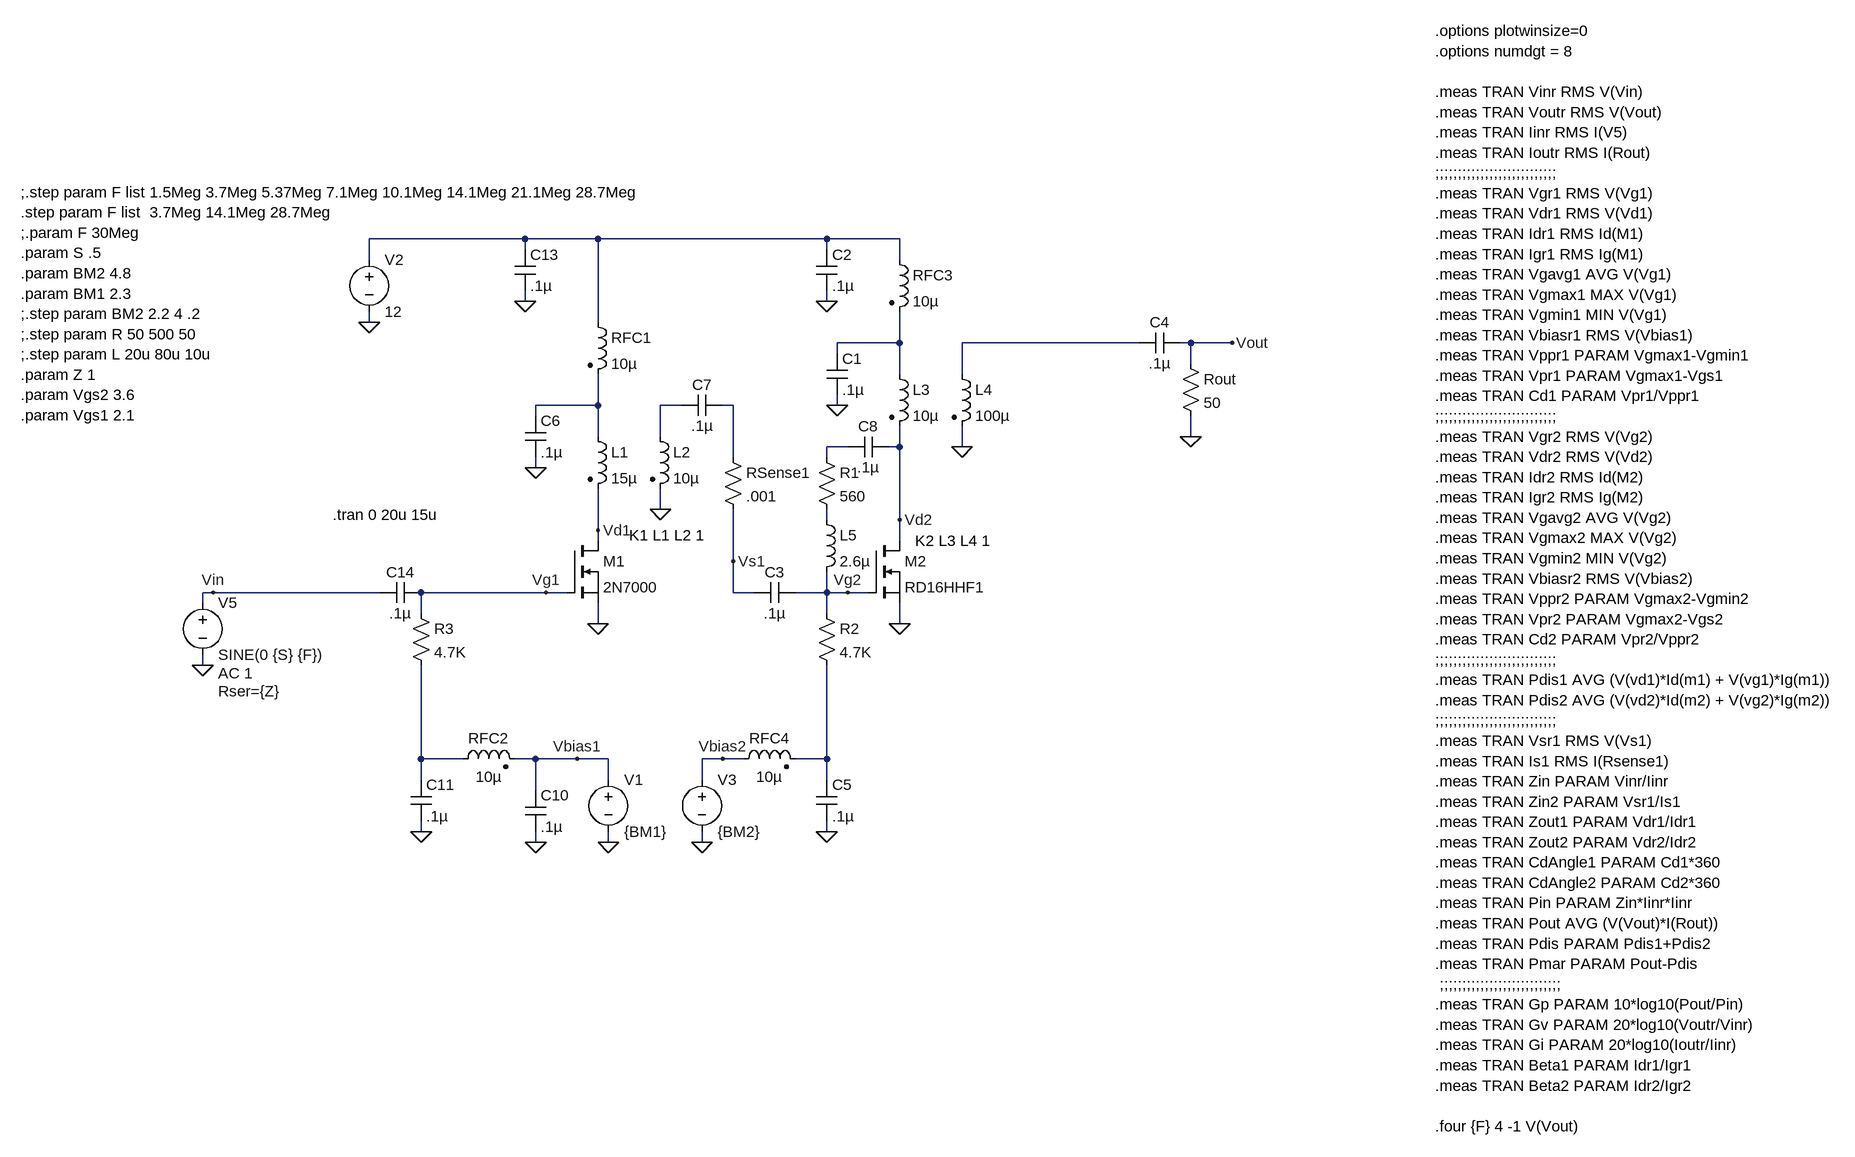
[diagram p0: schematic 2N7000 RD16HHF Power Amp Testing.asc]
2N7000 RD16HHF Power Amp Testing.asc, the LTspice schematic file:
Version 4
SHEET 1 3136 1616
WIRE 496 -176 256 -176
WIRE 608 -176 496 -176
WIRE 960 -176 608 -176
WIRE 1072 -176 960 -176
WIRE 496 -160 496 -176
WIRE 960 -160 960 -176
WIRE 256 -144 256 -176
WIRE 1072 -144 1072 -176
WIRE 496 -80 496 -96
WIRE 960 -80 960 -96
WIRE 256 -48 256 -64
WIRE 608 -48 608 -176
WIRE 1072 -16 1072 -64
WIRE 1072 -16 976 -16
WIRE 1440 -16 1168 -16
WIRE 1520 -16 1504 -16
WIRE 1584 -16 1520 -16
WIRE 976 0 976 -16
WIRE 1520 16 1520 -16
WIRE 1072 32 1072 -16
WIRE 1168 32 1168 -16
WIRE 608 80 608 32
WIRE 608 80 512 80
WIRE 736 80 704 80
WIRE 816 80 800 80
WIRE 976 80 976 64
WIRE 512 96 512 80
WIRE 608 128 608 80
WIRE 704 128 704 80
WIRE 1520 128 1520 96
WIRE 992 144 960 144
WIRE 1072 144 1072 112
WIRE 1072 144 1056 144
WIRE 1168 144 1168 112
WIRE 816 160 816 80
WIRE 960 160 960 144
WIRE 512 176 512 160
WIRE 704 240 704 208
WIRE 960 256 960 240
WIRE 1072 256 1072 144
WIRE 608 272 608 208
WIRE 608 288 608 272
WIRE 1072 288 1072 256
WIRE 816 320 816 240
WIRE 16 368 0 368
WIRE 272 368 16 368
WIRE 528 368 336 368
WIRE 560 368 528 368
WIRE 816 368 816 320
WIRE 848 368 816 368
WIRE 960 368 960 336
WIRE 960 368 912 368
WIRE 992 368 960 368
WIRE 1024 368 992 368
WIRE 0 384 0 368
WIRE 336 400 336 368
WIRE 960 400 960 368
WIRE 608 416 608 384
WIRE 1072 416 1072 384
WIRE 0 480 0 464
WIRE 336 624 336 480
WIRE 400 624 336 624
WIRE 512 624 480 624
WIRE 576 624 512 624
WIRE 624 624 576 624
WIRE 800 624 768 624
WIRE 832 624 800 624
WIRE 960 624 960 480
WIRE 960 624 912 624
WIRE 336 656 336 624
WIRE 624 656 624 624
WIRE 768 656 768 624
WIRE 960 656 960 624
WIRE 512 672 512 624
WIRE 336 736 336 720
WIRE 960 736 960 720
WIRE 512 752 512 736
WIRE 624 752 624 736
WIRE 768 752 768 736
FLAG 256 -48 0
FLAG 1520 128 0
FLAG 1584 -16 Vout
FLAG 0 480 0
FLAG 16 368 Vin
FLAG 608 416 0
FLAG 528 368 Vg1
FLAG 608 272 Vd1
FLAG 512 176 0
FLAG 512 752 0
FLAG 336 736 0
FLAG 624 752 0
FLAG 576 624 Vbias1
FLAG 496 -80 0
FLAG 704 240 0
FLAG 1072 416 0
FLAG 992 368 Vg2
FLAG 1072 256 Vd2
FLAG 976 80 0
FLAG 960 -80 0
FLAG 1168 144 0
FLAG 960 736 0
FLAG 816 320 Vs1
FLAG 768 752 0
FLAG 800 624 Vbias2
SYMBOL voltage 256 -160 R0
WINDOW 123 0 0 Left 2
WINDOW 39 0 0 Left 2
SYMATTR InstName V2
SYMATTR Value 12
SYMBOL res 1504 0 R0
SYMATTR InstName Rout
SYMATTR Value 50
SYMBOL voltage 0 368 R0
WINDOW 123 24 124 Left 2
WINDOW 39 24 152 Left 2
SYMATTR Value2 AC 1
SYMATTR SpiceLine Rser={Z}
SYMATTR InstName V5
SYMATTR Value SINE(0 {S} {F})
SYMBOL nmos 560 288 R0
SYMATTR InstName M1
SYMATTR Value 2N7000
SYMBOL ind2 592 112 R0
SYMATTR InstName L1
SYMATTR Value 15µ
SYMATTR Type ind
SYMBOL res 320 384 R0
SYMATTR InstName R3
SYMATTR Value 4.7K
SYMBOL ind2 592 -64 R0
SYMATTR InstName RFC1
SYMATTR Value 10µ
SYMATTR Type ind
SYMBOL cap 496 96 R0
SYMATTR InstName C6
SYMATTR Value .1µ
SYMBOL cap 1440 0 R270
WINDOW 0 32 32 VTop 2
WINDOW 3 0 32 VBottom 2
SYMATTR InstName C4
SYMATTR Value .1µ
SYMBOL ind2 384 640 R270
WINDOW 0 32 56 VTop 2
WINDOW 3 4 56 VBottom 2
SYMATTR InstName RFC2
SYMATTR Value 10µ
SYMATTR Type ind
SYMBOL cap 496 672 R0
SYMATTR InstName C10
SYMATTR Value .1µ
SYMBOL cap 320 656 R0
SYMATTR InstName C11
SYMATTR Value .1µ
SYMBOL voltage 624 640 R0
WINDOW 123 0 0 Left 2
WINDOW 39 0 0 Left 2
SYMATTR InstName V1
SYMATTR Value {BM1}
SYMBOL ind2 688 112 R0
SYMATTR InstName L2
SYMATTR Value 10µ
SYMATTR Type ind
SYMBOL cap 480 -160 R0
SYMATTR InstName C13
SYMATTR Value .1µ
SYMBOL cap 272 384 R270
WINDOW 0 32 32 VTop 2
WINDOW 3 0 32 VBottom 2
SYMATTR InstName C14
SYMATTR Value .1µ
SYMBOL nmos 1024 288 R0
SYMATTR InstName M2
SYMATTR Value RD16HHF1
SYMBOL ind2 1056 16 R0
SYMATTR InstName L3
SYMATTR Value 10µ
SYMATTR Type ind
SYMBOL ind2 1056 -160 R0
SYMATTR InstName RFC3
SYMATTR Value 10µ
SYMATTR Type ind
SYMBOL cap 960 0 R0
SYMATTR InstName C1
SYMATTR Value .1µ
SYMBOL ind2 1152 16 R0
SYMATTR InstName L4
SYMATTR Value 100µ
SYMATTR Type ind
SYMBOL cap 944 -160 R0
SYMATTR InstName C2
SYMATTR Value .1µ
SYMBOL res 800 144 R0
SYMATTR InstName RSense1
SYMATTR Value .001
SYMBOL cap 912 352 R90
WINDOW 0 0 32 VBottom 2
WINDOW 3 32 32 VTop 2
SYMATTR InstName C3
SYMATTR Value .1µ
SYMBOL res 944 384 R0
SYMATTR InstName R2
SYMATTR Value 4.7K
SYMBOL ind2 816 640 R270
WINDOW 0 32 56 VTop 2
WINDOW 3 4 56 VBottom 2
SYMATTR InstName RFC4
SYMATTR Value 10µ
SYMATTR Type ind
SYMBOL cap 944 656 R0
SYMATTR InstName C5
SYMATTR Value .1µ
SYMBOL cap 736 96 R270
WINDOW 0 32 32 VTop 2
WINDOW 3 0 32 VBottom 2
SYMATTR InstName C7
SYMATTR Value .1µ
SYMBOL voltage 768 640 R0
WINDOW 123 0 0 Left 2
WINDOW 39 0 0 Left 2
SYMATTR InstName V3
SYMATTR Value {BM2}
SYMBOL cap 1056 128 R90
WINDOW 0 0 32 VBottom 2
WINDOW 3 32 32 VTop 2
SYMATTR InstName C8
SYMATTR Value .1µ
SYMBOL res 944 144 R0
SYMATTR InstName R1
SYMATTR Value 560
SYMBOL ind 944 240 R0
SYMATTR InstName L5
SYMATTR Value 2.6µ
TEXT 200 248 Left 2 !.tran 0 20u 15u
TEXT 1896 -496 Left 2 !.options plotwinsize=0\n.options numdgt = 8\n \n.meas TRAN Vinr RMS V(Vin)\n.meas TRAN Voutr RMS V(Vout)\n.meas TRAN Iinr RMS I(V5)\n.meas TRAN Ioutr RMS I(Rout)\n;;;;;;;;;;;;;;;;;;;;;;;;;;;\n.meas TRAN Vgr1 RMS V(Vg1)\n.meas TRAN Vdr1 RMS V(Vd1)\n.meas TRAN Idr1 RMS Id(M1)\n.meas TRAN Igr1 RMS Ig(M1)\n.meas TRAN Vgavg1 AVG V(Vg1)\n.meas TRAN Vgmax1 MAX V(Vg1)\n.meas TRAN Vgmin1 MIN V(Vg1)\n.meas TRAN Vbiasr1 RMS V(Vbias1)\n.meas TRAN Vppr1 PARAM Vgmax1-Vgmin1\n.meas TRAN Vpr1 PARAM Vgmax1-Vgs1\n.meas TRAN Cd1 PARAM Vpr1/Vppr1\n;;;;;;;;;;;;;;;;;;;;;;;;;;;\n.meas TRAN Vgr2 RMS V(Vg2)\n.meas TRAN Vdr2 RMS V(Vd2)\n.meas TRAN Idr2 RMS Id(M2)\n.meas TRAN Igr2 RMS Ig(M2)\n.meas TRAN Vgavg2 AVG V(Vg2)\n.meas TRAN Vgmax2 MAX V(Vg2)\n.meas TRAN Vgmin2 MIN V(Vg2)\n.meas TRAN Vbiasr2 RMS V(Vbias2)\n.meas TRAN Vppr2 PARAM Vgmax2-Vgmin2\n.meas TRAN Vpr2 PARAM Vgmax2-Vgs2\n.meas TRAN Cd2 PARAM Vpr2/Vppr2\n;;;;;;;;;;;;;;;;;;;;;;;;;;;\n.meas TRAN Pdis1 AVG (V(vd1)*Id(m1) + V(vg1)*Ig(m1))\n.meas TRAN Pdis2 AVG (V(vd2)*Id(m2) + V(vg2)*Ig(m2))\n;;;;;;;;;;;;;;;;;;;;;;;;;;;\n.meas TRAN Vsr1 RMS V(Vs1)\n.meas TRAN Is1 RMS I(Rsense1)\n.meas TRAN Zin PARAM Vinr/Iinr\n.meas TRAN Zin2 PARAM Vsr1/Is1\n.meas TRAN Zout1 PARAM Vdr1/Idr1\n.meas TRAN Zout2 PARAM Vdr2/Idr2\n.meas TRAN CdAngle1 PARAM Cd1*360\n.meas TRAN CdAngle2 PARAM Cd2*360\n.meas TRAN Pin PARAM Zin*Iinr*Iinr\n.meas TRAN Pout AVG (V(Vout)*I(Rout))\n.meas TRAN Pdis PARAM Pdis1+Pdis2\n.meas TRAN Pmar PARAM Pout-Pdis\n ;;;;;;;;;;;;;;;;;;;;;;;;;;;\n.meas TRAN Gp PARAM 10*log10(Pout/Pin)\n.meas TRAN Gv PARAM 20*log10(Voutr/Vinr)\n.meas TRAN Gi PARAM 20*log10(Ioutr/Iinr)\n.meas TRAN Beta1 PARAM Idr1/Igr1\n.meas TRAN Beta2 PARAM Idr2/Igr2\n \n.four {F} 4 -1 V(Vout)
TEXT -280 -248 Left 2 !;.step param F list 1.5Meg 3.7Meg 5.37Meg 7.1Meg 10.1Meg 14.1Meg 21.1Meg 28.7Meg\n.step param F list  3.7Meg 14.1Meg 28.7Meg\n;.param F 30Meg\n.param S .5\n.param BM2 4.8\n.param BM1 2.3\n;.step param BM2 2.2 4 .2\n;.step param R 50 500 50\n;.step param L 20u 80u 10u\n.param Z 1\n.param Vgs2 3.6\n.param Vgs1 2.1
TEXT 656 280 Left 2 !K1 L1 L2 1
TEXT 1096 288 Left 2 !K2 L3 L4 1

The netlist it stands for:
* 2N7000 RD16HHF Power Amp Testing.asc
V2 N001 0 12
Rout Vout 0 50
V5 Vin 0 SINE(0 {S} {F}) AC 1 Rser={Z}
M1 Vd1 Vg1 0 0 2N7000
L1 N004 Vd1 15µ
R3 Vg1 N009 4.7K
L§RFC1 N001 N004 10µ
C6 N004 0 .1µ
C4 N003 Vout .1µ
L§RFC2 N009 Vbias1 10µ
C10 Vbias1 0 .1µ
C11 N009 0 .1µ
V1 Vbias1 0 {BM1}
L2 N005 0 10µ
C13 N001 0 .1µ
C14 Vin Vg1 .1µ
M2 Vd2 Vg2 0 0 RD16HHF1
L3 N002 Vd2 10µ
L§RFC3 N001 N002 10µ
C1 N002 0 .1µ
L4 N003 0 100µ
C2 N001 0 .1µ
RSense1 N006 Vs1 .001
C3 Vg2 Vs1 .1µ
R2 Vg2 N010 4.7K
L§RFC4 Vbias2 N010 10µ
C5 N010 0 .1µ
C7 N005 N006 .1µ
V3 Vbias2 0 {BM2}
C8 Vd2 N007 .1µ
R1 N007 N008 560
L5 N008 Vg2 2.6µ
.model NMOS NMOS
.model PMOS PMOS
.lib standard.mos
.tran 0 20u 15u
.options plotwinsize=0
.options numdgt = 8
.meas TRAN Vinr RMS V(Vin)
.meas TRAN Voutr RMS V(Vout)
.meas TRAN Iinr RMS I(V5)
.meas TRAN Ioutr RMS I(Rout)
;;;;;;;;;;;;;;;;;;;;;;;;;;;
.meas TRAN Vgr1 RMS V(Vg1)
.meas TRAN Vdr1 RMS V(Vd1)
.meas TRAN Idr1 RMS Id(M1)
.meas TRAN Igr1 RMS Ig(M1)
.meas TRAN Vgavg1 AVG V(Vg1)
.meas TRAN Vgmax1 MAX V(Vg1)
.meas TRAN Vgmin1 MIN V(Vg1)
.meas TRAN Vbiasr1 RMS V(Vbias1)
.meas TRAN Vppr1 PARAM Vgmax1-Vgmin1
.meas TRAN Vpr1 PARAM Vgmax1-Vgs1
.meas TRAN Cd1 PARAM Vpr1/Vppr1
;;;;;;;;;;;;;;;;;;;;;;;;;;;
.meas TRAN Vgr2 RMS V(Vg2)
.meas TRAN Vdr2 RMS V(Vd2)
.meas TRAN Idr2 RMS Id(M2)
.meas TRAN Igr2 RMS Ig(M2)
.meas TRAN Vgavg2 AVG V(Vg2)
.meas TRAN Vgmax2 MAX V(Vg2)
.meas TRAN Vgmin2 MIN V(Vg2)
.meas TRAN Vbiasr2 RMS V(Vbias2)
.meas TRAN Vppr2 PARAM Vgmax2-Vgmin2
.meas TRAN Vpr2 PARAM Vgmax2-Vgs2
.meas TRAN Cd2 PARAM Vpr2/Vppr2
;;;;;;;;;;;;;;;;;;;;;;;;;;;
.meas TRAN Pdis1 AVG (V(vd1)*Id(m1) + V(vg1)*Ig(m1))
.meas TRAN Pdis2 AVG (V(vd2)*Id(m2) + V(vg2)*Ig(m2))
;;;;;;;;;;;;;;;;;;;;;;;;;;;
.meas TRAN Vsr1 RMS V(Vs1)
.meas TRAN Is1 RMS I(Rsense1)
.meas TRAN Zin PARAM Vinr/Iinr
.meas TRAN Zin2 PARAM Vsr1/Is1
.meas TRAN Zout1 PARAM Vdr1/Idr1
.meas TRAN Zout2 PARAM Vdr2/Idr2
.meas TRAN CdAngle1 PARAM Cd1*360
.meas TRAN CdAngle2 PARAM Cd2*360
.meas TRAN Pin PARAM Zin*Iinr*Iinr
.meas TRAN Pout AVG (V(Vout)*I(Rout))
.meas TRAN Pdis PARAM Pdis1+Pdis2
.meas TRAN Pmar PARAM Pout-Pdis
 ;;;;;;;;;;;;;;;;;;;;;;;;;;;
.meas TRAN Gp PARAM 10*log10(Pout/Pin)
.meas TRAN Gv PARAM 20*log10(Voutr/Vinr)
.meas TRAN Gi PARAM 20*log10(Ioutr/Iinr)
.meas TRAN Beta1 PARAM Idr1/Igr1
.meas TRAN Beta2 PARAM Idr2/Igr2
.four {F} 4 -1 V(Vout)
;.step param F list 1.5Meg 3.7Meg 5.37Meg 7.1Meg 10.1Meg 14.1Meg 21.1Meg 28.7Meg
.step param F list  3.7Meg 14.1Meg 28.7Meg
;.param F 30Meg
.param S .5
.param BM2 4.8
.param BM1 2.3
;.step param BM2 2.2 4 .2
;.step param R 50 500 50
;.step param L 20u 80u 10u
.param Z 1
.param Vgs2 3.6
.param Vgs1 2.1
K1 L1 L2 1
K2 L3 L4 1
.backanno
.end